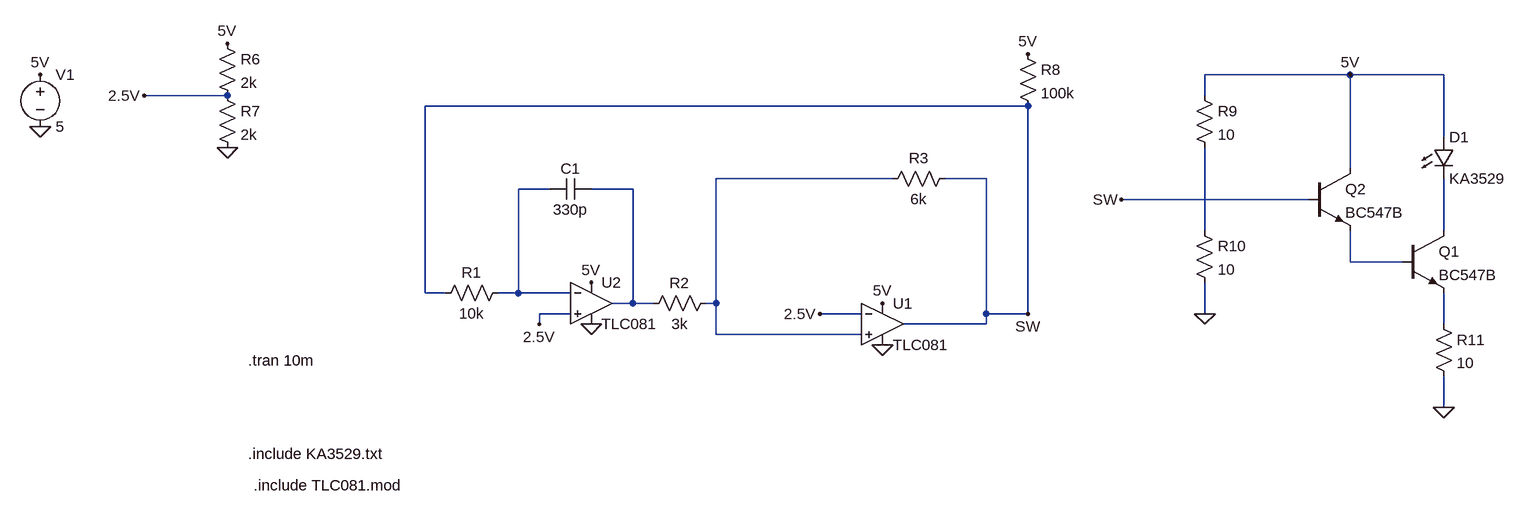
[diagram p0: schematic wave generator.asc]
wave generator.asc, the LTspice schematic file:
Version 4
SHEET 1 2152 792
WIRE 1168 144 944 144
WIRE 1312 144 1168 144
WIRE -560 176 -688 176
WIRE 944 176 944 144
WIRE 672 192 -256 192
WIRE 1312 240 1312 144
WIRE 1168 288 1168 144
WIRE 464 304 192 304
WIRE 608 304 544 304
WIRE -64 320 -112 320
WIRE 64 320 0 320
WIRE 1104 336 816 336
WIRE 944 384 944 256
WIRE 1312 384 1312 304
WIRE 1168 432 1168 384
WIRE 1248 432 1168 432
WIRE -256 480 -256 192
WIRE -224 480 -256 480
WIRE -112 480 -112 320
WIRE -112 480 -144 480
WIRE -32 480 -112 480
WIRE 64 496 64 320
WIRE 64 496 32 496
WIRE 96 496 64 496
WIRE 192 496 192 304
WIRE 192 496 176 496
WIRE -32 512 -80 512
WIRE 416 512 352 512
WIRE 608 512 608 304
WIRE 672 512 672 192
WIRE 672 512 608 512
WIRE 944 512 944 464
WIRE -80 528 -80 512
WIRE 608 528 608 512
WIRE 608 528 480 528
WIRE 1312 528 1312 480
WIRE 192 544 192 496
WIRE 416 544 192 544
WIRE 1312 656 1312 608
FLAG 448 496 5V
FLAG 0 464 5V
FLAG -848 144 5V
FLAG -848 224 0
FLAG 448 560 0
FLAG 0 528 0
FLAG -688 176 2.5V
FLAG -560 96 5V
FLAG -560 256 0
FLAG -80 528 2.5V
FLAG 352 512 2.5V
FLAG 672 112 5V
FLAG 944 512 0
FLAG 1312 656 0
FLAG 1168 144 5V
FLAG 672 512 SW
FLAG 816 336 SW
SYMBOL res 560 288 R90
WINDOW 0 0 56 VBottom 2
WINDOW 3 32 56 VTop 2
SYMATTR InstName R3
SYMATTR Value 6k
SYMBOL res 192 480 R90
WINDOW 0 0 56 VBottom 2
WINDOW 3 32 56 VTop 2
SYMATTR InstName R2
SYMATTR Value 3k
SYMBOL res -128 464 R90
WINDOW 0 0 56 VBottom 2
WINDOW 3 32 56 VTop 2
SYMATTR InstName R1
SYMATTR Value 10k
SYMBOL cap 0 304 R90
WINDOW 0 0 32 VBottom 2
WINDOW 3 32 32 VTop 2
SYMATTR InstName C1
SYMATTR Value 330p
SYMBOL voltage -848 128 R0
WINDOW 123 0 0 Left 0
WINDOW 39 0 0 Left 0
SYMATTR InstName V1
SYMATTR Value 5
SYMBOL res -576 80 R0
SYMATTR InstName R6
SYMATTR Value 2k
SYMBOL res -576 160 R0
SYMATTR InstName R7
SYMATTR Value 2k
SYMBOL res 656 96 R0
SYMATTR InstName R8
SYMATTR Value 100k
SYMBOL npn 1248 384 R0
SYMATTR InstName Q1
SYMATTR Value BC547B
SYMBOL npn 1104 288 R0
SYMATTR InstName Q2
SYMATTR Value BC547B
SYMBOL LED 1296 240 R0
SYMATTR InstName D1
SYMATTR Value KA3529
SYMBOL res 928 160 R0
SYMATTR InstName R9
SYMATTR Value 10
SYMBOL res 928 368 R0
SYMATTR InstName R10
SYMATTR Value 10
SYMBOL res 1296 512 R0
SYMATTR InstName R11
SYMATTR Value 10
SYMBOL OpAmps\\opamp2 0 432 R0
SYMATTR InstName U2
SYMATTR Value TLC081
SYMBOL OpAmps\\opamp2 448 464 R0
SYMATTR InstName U1
SYMATTR Value TLC081
TEXT -528 584 Left 2 !.tran 10m
TEXT -528 728 Left 2 !.include KA3529.txt
TEXT -520 776 Left 2 !.include TLC081.mod

The netlist it stands for:
* wave generator.asc
R3 SW N001 6k
R2 N001 N003 3k
R1 N002 SW 10k
C1 N003 N002 330p
V1 5V 0 5
R6 5V 2.5V 2k
R7 2.5V 0 2k
R8 5V SW 100k
Q1 N005 N006 N007 0 BC547B
Q2 5V SW N006 0 BC547B
D1 5V N005 KA3529
R9 5V N004 10
R10 N004 0 10
R11 N007 0 10
XU2 2.5V N002 5V 0 N003 TLC081  ; pins In+ In- V+ V- OUT
XU1 N001 2.5V 5V 0 SW TLC081  ; pins In+ In- V+ V- OUT
.model D D
.lib standard.dio
.model NPN NPN
.model PNP PNP
.lib standard.bjt
.tran 10m
.include KA3529.txt
.include TLC081.mod
.backanno
.end